# EAGLE board DAC STM32 Board v5 - AD5391 (EAGLE 9.5.2)
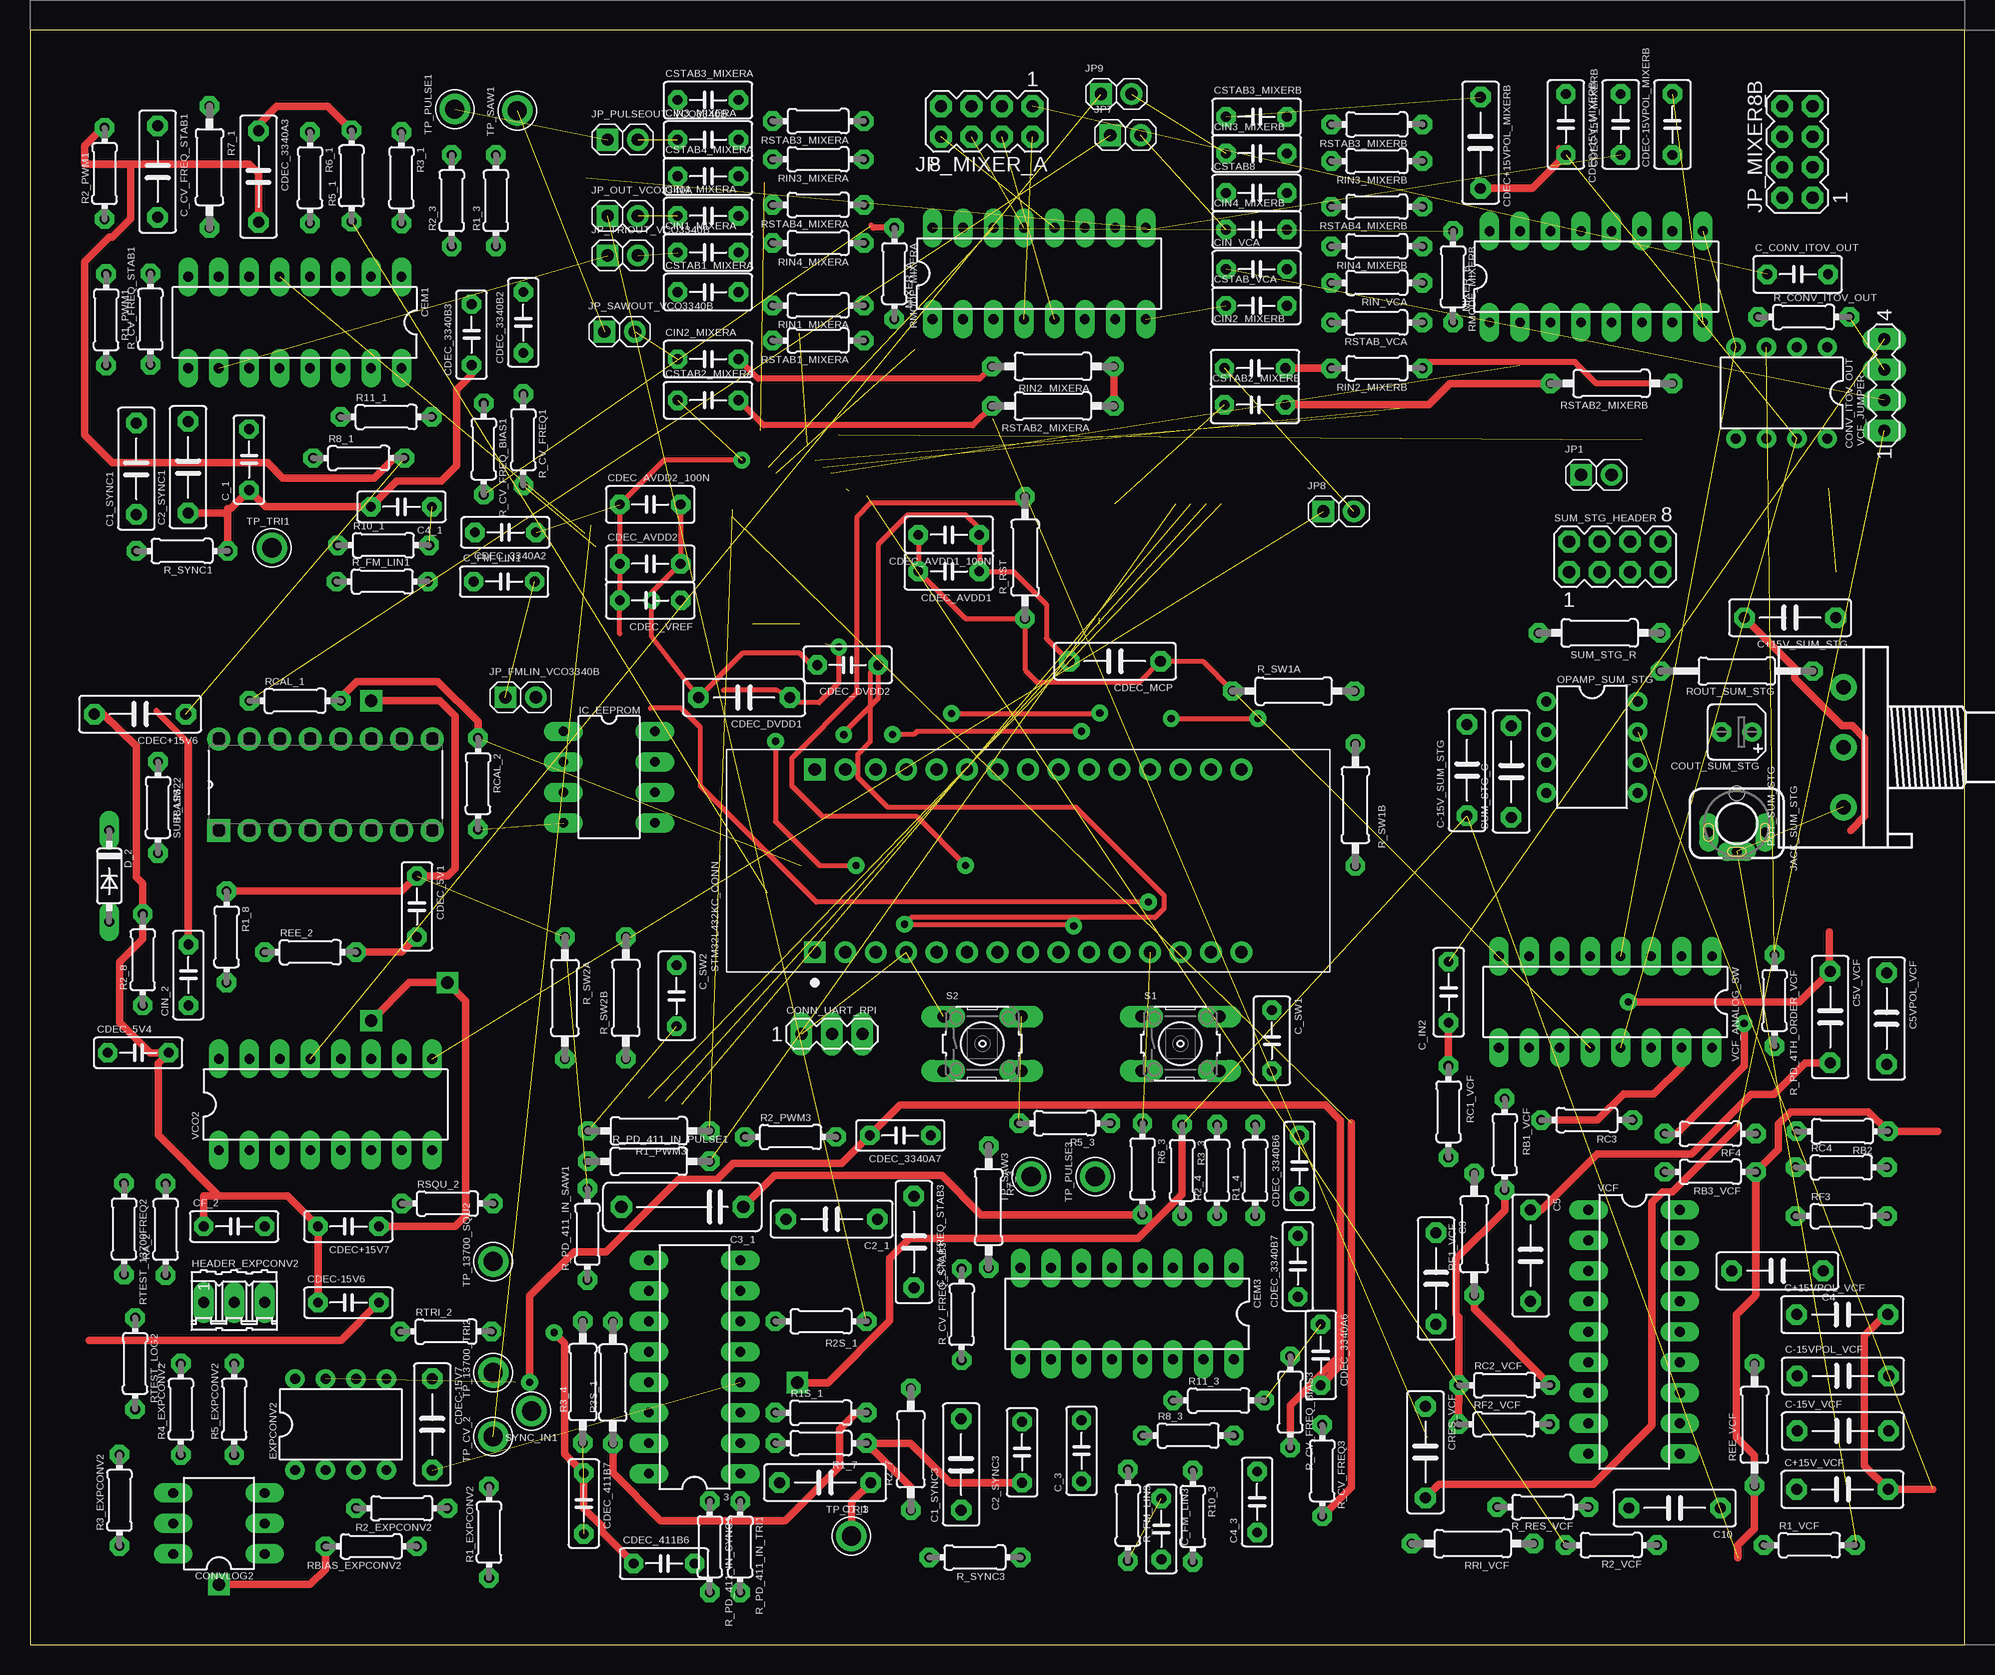
[diagram p6: board, top side]
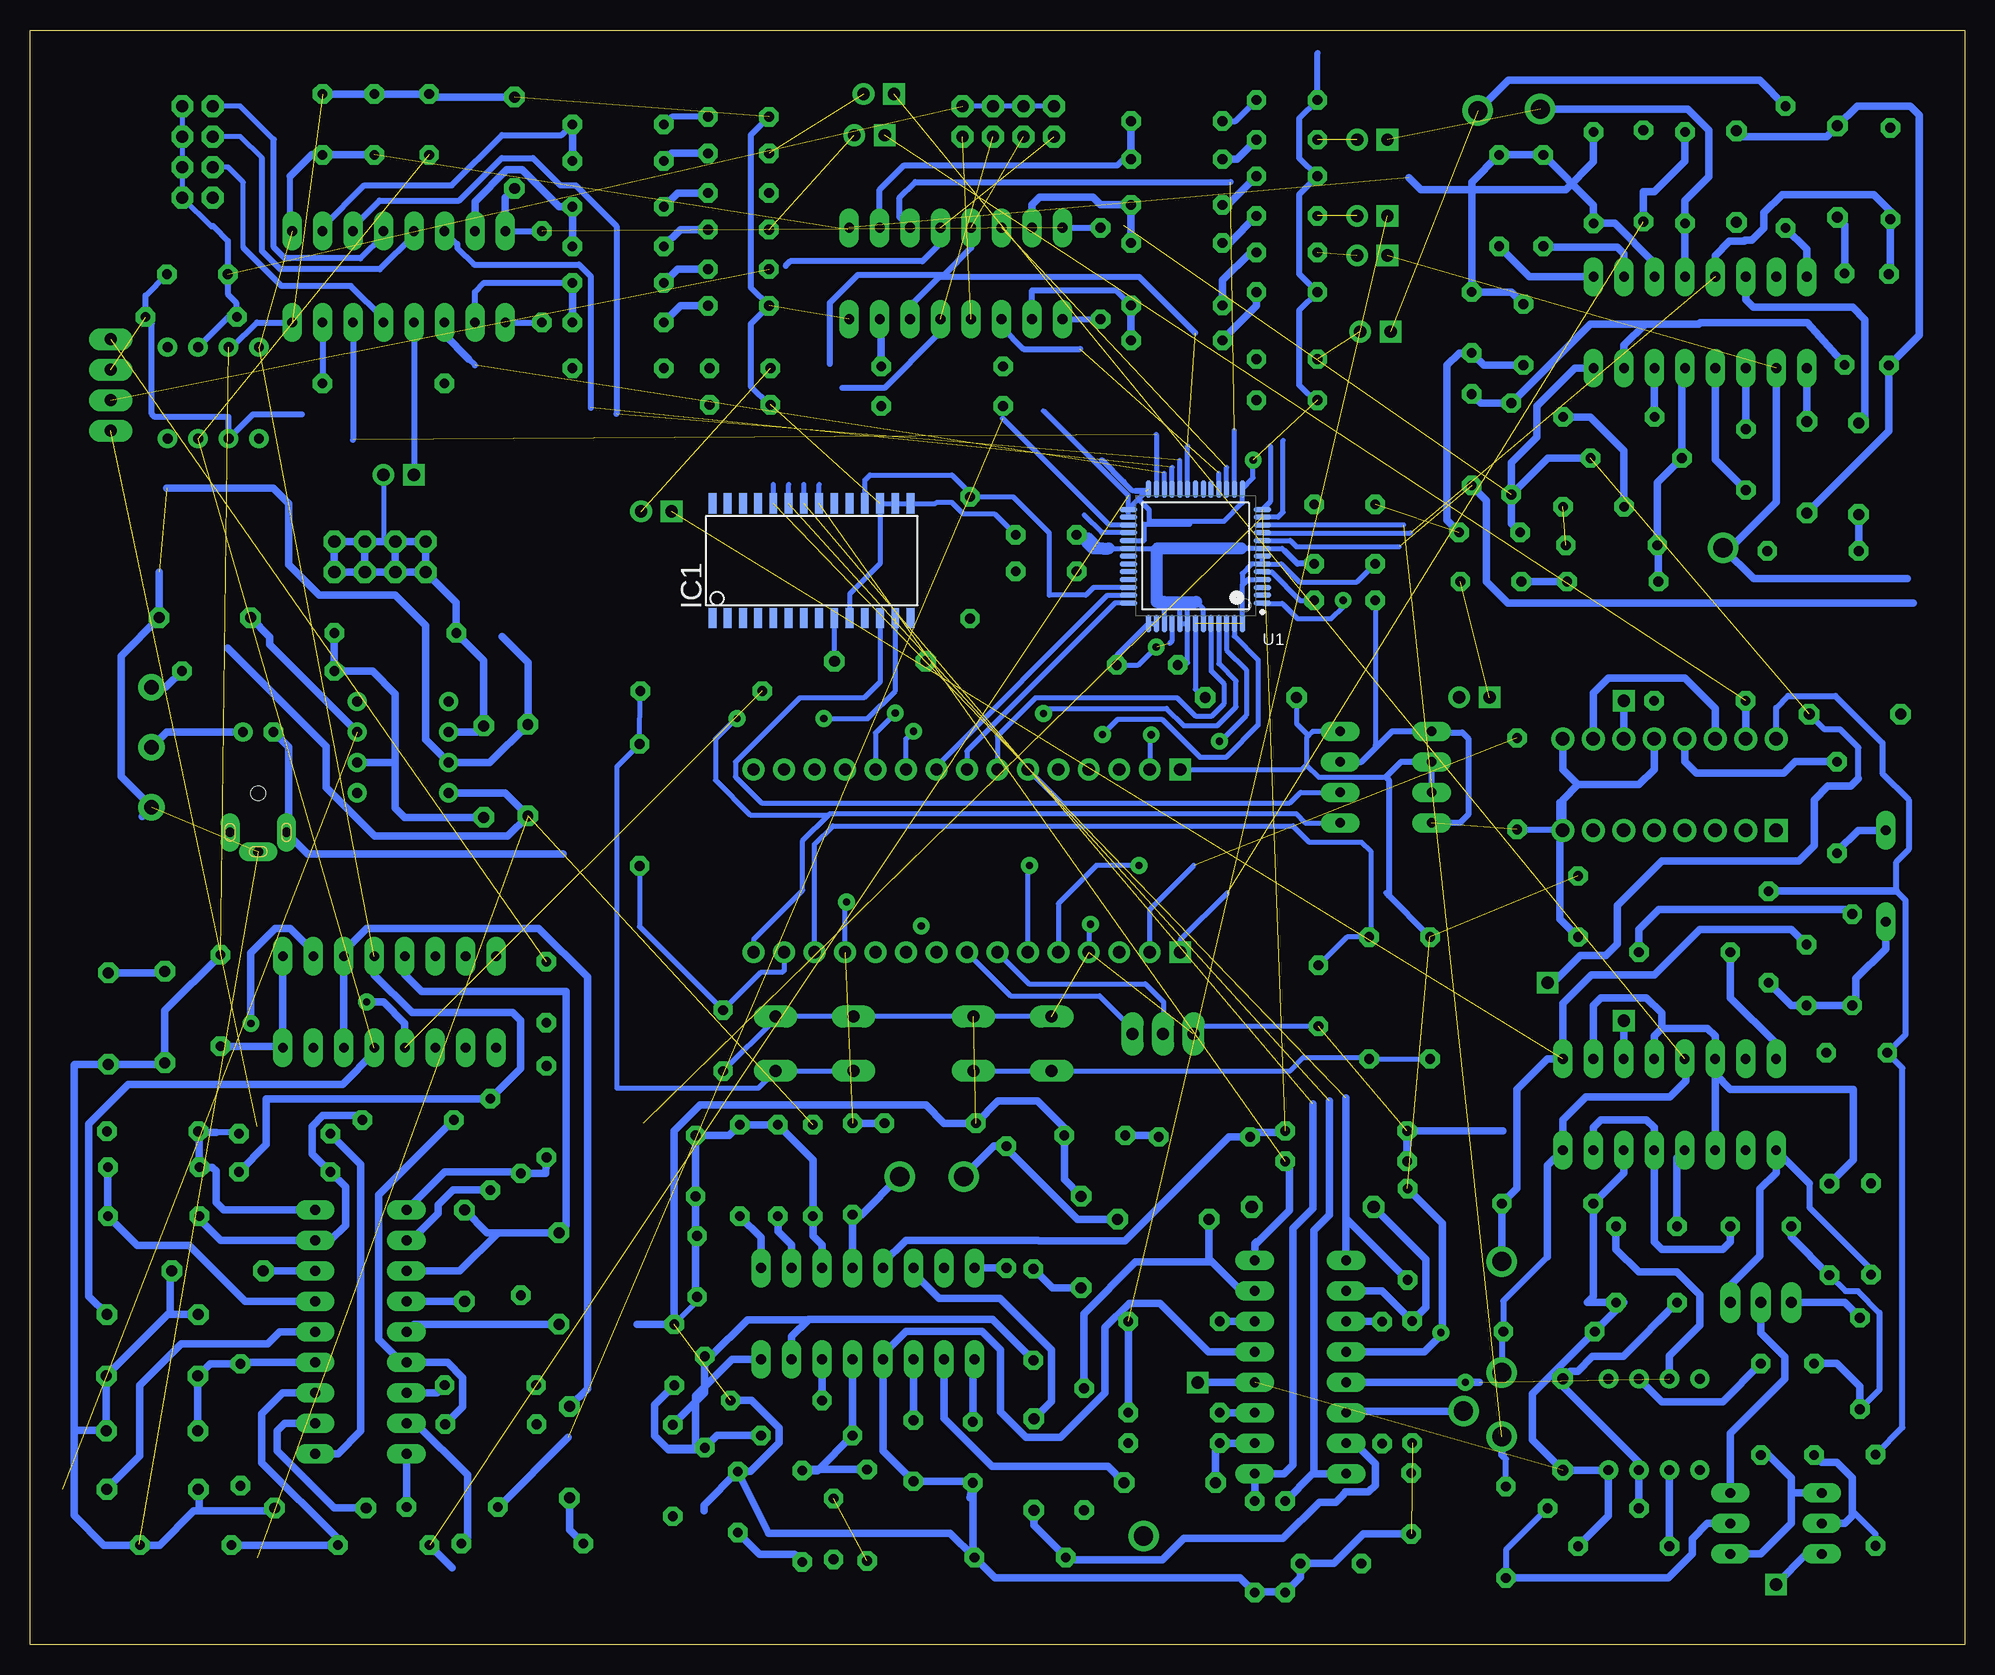
[diagram p7: board, bottom side, seen from below]

Size 161.29 x 134.62 mm. Coordinates in mm from the lower left corner, seen from the top.
Outline: 0,0 161.29,0 161.29,134.62 0,134.62 0,0
Copper layers (1*16): Top 0.035mm / dielectric 1.5mm / Bottom 0.035mm
Design rules "ENSEA_2019 *": minimum track width 0.4mm, minimum drill 0.6mm, track to track 0.4mm, track to pad 0.4mm, pad to pad 0.4mm, via to via 0.4mm, smd to smd 0.4mm, copper to edge 1mm, drill to drill 0.4mm, minimum pad ring 0.4mm, minimum via ring 0.4mm, stop-mask expansion 4mil, vias tented up to drill 0mil, thermal gap 0.4mm

## Footprints (pad centres in the part's own frame; a part is rotated, then mirrored left to right if it is on the bottom)
DIL16 = drill 0.813 long: 1 -8.89,-3.81; 2 -6.35,-3.81; 3 -3.81,-3.81; 4 -1.27,-3.81; 5 1.27,-3.81; 6 3.81,-3.81; 7 6.35,-3.81; 8 8.89,-3.81; 9 8.89,3.81; 10 6.35,3.81; 11 3.81,3.81; 12 1.27,3.81; 13 -1.27,3.81; 14 -3.81,3.81; 15 -6.35,3.81; 16 -8.89,3.81
C075-032X103 = drill 0.914 octagon: 1 -3.81,0; 2 3.81,0
C050-025X075 = drill 0.813 octagon: 1 -2.54,0; 2 2.54,0
C102-043X133 = drill 1.016 octagon: 1 -5.08,0; 2 5.08,0
C050-030X075 = drill 0.813 octagon: 1 -2.54,0; 2 2.54,0
MA03-1 = drill 1.016 long: 1 -2.54,0; 2 0,0; 3 2.54,0
DIL08 = drill 0.813 pad 1.27: 1 -3.81,-3.81; 2 -1.27,-3.81; 3 1.27,-3.81; 4 3.81,-3.81; 5 3.81,3.81; 6 1.27,3.81; 7 -1.27,3.81; 8 -3.81,3.81
DIL06 = drill 0.813 long: 1 -2.54,-3.81; 2 0,-3.81; 3 2.54,-3.81; 4 2.54,3.81; 5 0,3.81; 6 -2.54,3.81
B45181A = drill 0.813 pad 1.6: + -1.27,0 | drill 0.813 pad 1.6 octagon: - 1.27,0
DO35-7 = drill 0.813 long: A 3.81,0; C -3.81,0
03P = drill 0.914 long: 1 -2.54,0; 2 0,0; 3 2.54,0
SO28W = smd 0.65 x 1.7: 1 -7.62,-4.78; 2 -6.35,-4.78; 3 -5.08,-4.78; 4 -3.81,-4.78; 5 -2.54,-4.78; 6 -1.27,-4.78; 7 0,-4.78; 8 1.27,-4.78; 9 2.54,-4.78; 10 3.81,-4.78; 11 5.08,-4.78; 12 6.35,-4.78; 13 7.62,-4.78; 14 8.89,-4.78; 15 8.89,4.78; 16 7.62,4.78; 17 6.35,4.78; 18 5.08,4.78; 19 3.81,4.78; 20 2.54,4.78; 21 1.27,4.78; 22 0,4.78; 23 -1.27,4.78; 24 -2.54,4.78; 25 -3.81,4.78; 26 -5.08,4.78; 27 -6.35,4.78; 28 -7.62,4.78
DIL8 = drill 0.813 long: 1 -3.81,-3.81; 2 -1.27,-3.81; 3 1.27,-3.81; 4 3.81,-3.81; 5 3.81,3.81; 6 1.27,3.81; 7 -1.27,3.81; 8 -3.81,3.81
1502_01 = drill 0.8 pad 1.2 long: 1 0,2.35; 2 -2.35,0.75; 3 2.35,0.75 | hole 1.2: 0,-2.5
HDR2X1 = drill 1.016 square: 1 0,0 | drill 1.016: 2 2.54,0
MA04-2 = drill 1.016 octagon: 1 -3.81,-1.27; 2 -3.81,1.27; 3 -1.27,-1.27; 4 -1.27,1.27; 5 1.27,-1.27; 6 1.27,1.27; 7 3.81,-1.27; 8 3.81,1.27
3RP/1610N = drill 1.2 pad 2.184: 1 -5,0; 2 0,0; 3 5,0
0204/7 = drill 0.813 octagon: 1 -3.81,0; 2 3.81,0
0207/10 = drill 0.813 octagon: 1 -5.08,0; 2 5.08,0
0207/12 = drill 0.813 octagon: 1 -6.35,0; 2 6.35,0
B3F-10XX = drill 1.016 long: 1 -3.251,2.261; 2 3.251,2.261; 3 -3.251,-2.261; 4 3.251,-2.261
MODULE_NUCLEO-F303K8 = drill 1.02 square: 3.1 -7.62,17.78; 4.1 7.62,17.78 | drill 1.02: 3.2 -7.62,15.24; 3.3 -7.62,12.7; 3.4 -7.62,10.16; 3.5 -7.62,7.62; 3.6 -7.62,5.08; 3.7 -7.62,2.54; 3.8 -7.62,0; 3.9 -7.62,-2.54; 3.10 -7.62,-5.08; 3.11 -7.62,-7.62; 3.12 -7.62,-10.16; 3.13 -7.62,-12.7; 3.14 -7.62,-15.24; 3.15 -7.62,-17.78; 4.2 7.62,15.24; 4.3 7.62,12.7; 4.4 7.62,10.16; 4.5 7.62,7.62; 4.6 7.62,5.08; 4.7 7.62,2.54; 4.8 7.62,0; 4.9 7.62,-2.54; 4.10 7.62,-5.08; 4.11 7.62,-7.62; 4.12 7.62,-10.16; 4.13 7.62,-12.7; 4.14 7.62,-15.24; 4.15 7.62,-17.78
DIP254P762X420-16 = drill 1.118 square: 1 -7.62,17.78 | drill 1.118: 2 -7.62,15.24; 3 -7.62,12.7; 4 -7.62,10.16; 5 -7.62,7.62; 6 -7.62,5.08; 7 -7.62,2.54; 8 -7.62,0; 9 0,0; 10 0,2.54; 11 0,5.08; 12 0,7.62; 13 0,10.16; 14 0,12.7; 15 0,15.24; 16 0,17.78
TESTPOINT_63 = drill 1.6 pad 2.54: P$1 0,0
ANALOG_DEVICES_AD5391BSTZ-3_0 = smd 1.45 x 0.45: 1 -5.6,3.9; 2 -5.6,3.25; 3 -5.6,2.6; 4 -5.6,1.95; 5 -5.6,1.3; 6 -5.6,0.65; 7 -5.6,0; 8 -5.6,-0.65; 9 -5.6,-1.3; 10 -5.6,-1.95; 11 -5.6,-2.6; 12 -5.6,-3.25; 13 -5.6,-3.9; 27 5.6,-3.9; 28 5.6,-3.25; 29 5.6,-2.6; 30 5.6,-1.95; 31 5.6,-1.3; 32 5.6,-0.65; 33 5.6,0; 34 5.6,0.65; 35 5.6,1.3; 36 5.6,1.95; 37 5.6,2.6; 38 5.6,3.25; 39 5.6,3.9 | smd 0.45 x 1.45: 14 -3.9,-5.6; 15 -3.25,-5.6; 16 -2.6,-5.6; 17 -1.95,-5.6; 18 -1.3,-5.6; 19 -0.65,-5.6; 20 0,-5.6; 21 0.65,-5.6; 22 1.3,-5.6; 23 1.95,-5.6; 24 2.6,-5.6; 25 3.25,-5.6; 26 3.9,-5.6; 40 3.9,5.6; 41 3.25,5.6; 42 2.6,5.6; 43 1.95,5.6; 44 1.3,5.6; 45 0.65,5.6; 46 0,5.6; 47 -0.65,5.6; 48 -1.3,5.6; 49 -1.95,5.6; 50 -2.6,5.6; 51 -3.25,5.6; 52 -3.9,5.6
DIL18 = drill 0.813 long: 1 -10.16,-3.81; 2 -7.62,-3.81; 3 -5.08,-3.81; 4 -2.54,-3.81; 5 0,-3.81; 6 2.54,-3.81; 7 5.08,-3.81; 8 7.62,-3.81; 9 10.16,-3.81; 10 10.16,3.81; 11 7.62,3.81; 12 5.08,3.81; 13 2.54,3.81; 14 0,3.81; 15 -2.54,3.81; 16 -5.08,3.81; 17 -7.62,3.81; 18 -10.16,3.81
MA04-1 = drill 1.016 long: 1 -3.81,0; 2 -1.27,0; 3 1.27,0; 4 3.81,0

## Placement (x,y rotation side)
3  ADG411N  [DIL16]  55.39,23.17 90 top
C1_1  470n  [C075-032X103]  66.27,13.53 180 top
C1_SYNC1  1n  [C075-032X103]  8.86,98.05 90 top
C1_SYNC3  1n  [C075-032X103]  77.62,15.04 90 top
C2_1  470n  [C075-032X103]  66.82,35.49 180 top
C2_SYNC1  100n  [C075-032X103]  13.18,98.18 90 top
C2_SYNC3  100n  [C050-025X075]  82.7,16.06 90 top
C3  300p  [C075-032X103]  117.2,30.55 270 top
C3_1  470n  [C102-043X133]  54.38,36.51 180 top
C4  300p  [C075-032X103]  145.65,31.18 180 top
C4_1  10n  [C050-025X075]  30.96,94.87 180 top
C4_3  10n  [C050-025X075]  102.29,11.92 90 top
C5  300p  [C075-032X103]  125.08,32.45 270 top
C5V_VCF  100n  [C075-032X103]  150.05,52.34 270 top
C5VPOL_VCF  100n  [C075-032X103]  154.75,52.22 270 top
C10  300p  [C075-032X103]  137.09,11.41 180 top
C+15V_SUM_STG  100n  [C075-032X103]  146.71,85.63 180 top
C+15V_VCF  100n  [C075-032X103]  151.07,12.97 0 top
C+15VPOL_VCF  1u  [C075-032X103]  151.06,27.54 0 top
C-15V_SUM_STG  100n  [C075-032X103]  119.79,72.93 90 top
C-15V_VCF  100n  [C075-032X103]  151.11,17.85 0 top
C-15VPOL_VCF  1u  [C075-032X103]  151.11,22.42 0 top
C_1  1n  [C050-025X075]  18.26,98.81 90 top
C_3  1n  [C050-025X075]  87.65,16.18 90 top
C_CONV_ITOV_OUT  1p  [C050-030X075]  147.34,114.26 0 top
C_CV_FREQ_STAB1  10n  [C075-032X103]  10.64,122.81 270 top
C_CV_FREQ_STAB3  10n  [C075-032X103]  73.68,33.58 270 top
C_FM_LIN1  100n  [C050-025X075]  39.52,88.64 0 top
C_FM_LIN3  100n  [C050-025X075]  94.31,9.67 270 top
C_IN2  470n  [C050-025X075]  118.25,54.42 90 top
C_SW1  100n  [C050-030X075]  103.52,50.37 270 top
C_SW2  100n  [C050-030X075]  53.89,54.11 270 top
CDEC+15V6  100n  [C075-032X103]  9.18,77.6 180 top
CDEC+15V7  100n  [C050-025X075]  26.54,34.89 180 top
CDEC+15V_MIXERB  100n  [C050-030X075]  128.02,126.75 270 top
CDEC+15VPOL_MIXERB  100n  [C075-032X103]  120.9,125.22 270 top
CDEC-15V6  100n  [C050-025X075]  26.54,28.54 0 top
CDEC-15V7  100n  [C075-032X103]  33.53,18.38 270 top
CDEC-15V_MIXERB  100n  [C050-030X075]  132.59,126.75 90 top
CDEC-15VPOL_MIXERB  100n  [C050-030X075]  136.91,126.75 90 top
CDEC_5V1  100n  [C050-025X075]  32.26,61.56 270 top
CDEC_5V4  100n  [C050-025X075]  9.02,49.37 0 top
CDEC_411B6  100n  [C050-025X075]  52.85,6.79 0 top
CDEC_411B7  10u  [C050-025X075]  46.16,11.79 270 top
CDEC_3340A2  100n  [C050-025X075]  39.63,92.74 180 top
CDEC_3340A3  10u  [C075-032X103]  19.05,122.4 270 top
CDEC_3340A6  100n  [C050-025X075]  107.59,24.19 270 top
CDEC_3340A7  10u  [C050-025X075]  72.54,42.47 180 top
CDEC_3340B2  100n  [C050-025X075]  41.12,110.24 90 top
CDEC_3340B3  10u  [C050-025X075]  36.8,109.22 90 top
CDEC_3340B6  100n  [C050-025X075]  105.81,39.93 90 top
CDEC_3340B7  10u  [C050-025X075]  105.68,31.55 90 top
CDEC_AVDD1  10u  [C050-030X075]  76.59,89.49 180 top
CDEC_AVDD1_100N  100n  [C050-030X075]  76.59,92.54 180 top
CDEC_AVDD2  10u  [C050-030X075]  51.7,90.12 0 top
CDEC_AVDD2_100N  100n  [C050-030X075]  51.7,95.08 0 top
CDEC_DVDD1  100n  [C075-032X103]  59.52,78.97 180 top
CDEC_DVDD2  100n  [C050-030X075]  68.16,81.69 180 top
CDEC_MCP  100n  [C075-032X103]  90.43,82 180 top
CDEC_VREF  100n  [C050-030X075]  51.7,87.08 180 top
CEM1  CEM3340  [DIL16]  22.07,110.24 180 top
CEM3  CEM3340  [DIL16]  91.46,27.61 180 top
CF_2  100nF  [C050-025X075]  17.02,34.89 0 top
CIN1_MIXERA  470n  [C050-030X075]  56.52,116.08 0 top
CIN2_MIXERA  470n  [C050-030X075]  56.52,107.19 0 top
CIN2_MIXERB  470n  [C050-030X075]  102.11,106.43 0 top
CIN3_MIXERA  470n  [C050-030X075]  56.52,125.48 0 top
CIN3_MIXERB  470n  [C050-030X075]  102.23,124.33 0 top
CIN4_MIXERA  470n  [C050-030X075]  56.52,119.13 0 top
CIN4_MIXERB  470n  [C050-030X075]  102.23,117.98 0 top
CIN_2  470n  [C050-025X075]  13.21,55.84 90 top
CIN_VCA  470n  [C050-030X075]  102.23,114.68 0 top
CONN_UART_RPI  [MA03-1]  66.85,50.94 0 top
CONV_ITOV_OUT  NE5534AN  [DIL08]  146.01,104.37 180 top
CONVLOG2  BC857BS  [DIL06]  15.75,10.12 90 top
COUT_SUM_STG  22u  [B45181A]  142.27,76.1 180 top
CRES_VCF  1u  [C075-032X103]  116.31,16.07 270 top
CSTAB1_MIXERA  560p  [C050-030X075]  56.52,112.78 0 top
CSTAB2_MIXERA  560p  [C050-030X075]  56.52,103.76 0 top
CSTAB2_MIXERB  560p  [C050-030X075]  102.11,103.38 0 top
CSTAB3_MIXERA  560p  [C050-030X075]  56.52,128.78 0 top
CSTAB3_MIXERB  560p  [C050-030X075]  102.23,127.38 0 top
CSTAB4_MIXERA  560p  [C050-030X075]  56.52,122.43 0 top
CSTAB8  560p  [C050-030X075]  102.23,121.03 0 top
CSTAB_VCA  560p  [C050-030X075]  102.23,111.63 0 top
D_2  1N4148DO35-7  [DO35-7]  6.6,64.1 270 top
EXPCONV2  TL081  [DIL08]  25.91,18.38 0 top
HEADER_EXPCONV2  [03P]  17.02,28.54 0 top
IC1  MCP23017SO  [SO28W]  96.78,90.38 0 bottom
IC_EEPROM  24C04AP  [DIL8]  48.27,72.34 270 top
JACK_SUM_STG  1502_01  [1502_01]  142.27,68.48 180 top
JP1  JUMPER  [HDR2X1]  129.29,97.54 0 top
JP7  JUMPER  [HDR2X1]  90.04,125.86 0 top
JP8  JUMPER  [HDR2X1]  107.82,94.49 0 top
JP9  JUMPER  [HDR2X1]  89.28,129.29 0 top
JP_FMLIN_VCO3340B  JUMPER  [HDR2X1]  39.62,78.99 0 top
JP_MIXER_A  [MA04-2]  79.76,127 180 top
JP_MIXER_B  [MA04-2]  147.32,124.46 90 top
JP_OUT_VCO3340A  JUMPER  [HDR2X1]  48.13,119.13 0 top
JP_PULSEOUT_VCO3340B  JUMPER  [HDR2X1]  48.13,125.48 0 top
JP_SAWOUT_VCO3340B  JUMPER  [HDR2X1]  47.88,109.47 0 top
JP_TRIOUT_VCO3340B  JUMPER  [HDR2X1]  48.13,115.82 0 top
MIXER_A  SSM2164_MULTI  [DIL16]  84.12,114.32 0 top
MIXER_B  SSM2164_MULTI  [DIL16]  130.56,114.05 0 top
OPAMP_SUM_STG  NE5534AN  [DIL08]  130.2,74.83 270 top
POT_SUM_STG  100kB  [3RP/1610N]  151.16,74.83 90 top
R1_3  30k  [0204/7]  38.83,120.4 90 top
R1_4  30k  [0204/7]  102.13,39.55 90 top
R1_7  100k  [0204/7]  65.93,16.82 180 top
R1_8  100k  [0204/7]  16.38,59.02 270 top
R1_EXPCONV2  330  [0204/7]  38.26,9.4 90 top
R1_PWM1  68k  [0204/7]  6.34,110.46 270 top
R1_PWM3  68k  [0207/10]  51.58,42.85 180 top
R1_VCF  10k  [0204/7]  148.32,8.32 0 top
R1S_1  1k  [0204/7]  65.93,19.36 0 top
R2_3  5.6k  [0204/7]  35.15,120.4 90 top
R2_4  5.6k  [0204/7]  98.95,39.55 90 top
R2_7  100k  [0207/10]  73.43,16.31 90 top
R2_8  100k  [0204/7]  9.4,57.11 90 top
R2_EXPCONV2  10  [0204/7]  30.99,11.39 180 top
R2_PWM1  330k  [0204/7]  6.22,122.65 90 top
R2_PWM3  330k  [0204/7]  63.39,42.35 0 top
R2_VCF  100k  [0204/7]  131.81,8.32 180 top
R2S_1  1k  [0204/7]  65.93,26.98 180 top
R3_1  820  [0204/7]  30.96,122.31 270 top
R3_3  820  [0204/7]  96.03,39.55 270 top
R3_4  100k  [0207/10]  46.08,21.91 90 top
R3_EXPCONV2  260  [0204/7]  7.46,12.07 90 top
R3S_1  1k  [0207/10]  48.59,21.86 90 top
R4_EXPCONV2  10  [0204/7]  12.57,19.65 90 top
R5_1  10k  [0204/7]  26.8,122.46 90 top
R5_3  10k  [0204/7]  86.25,43.49 180 top
R5_EXPCONV2  110  [0204/7]  17.02,19.65 90 top
R6_1  33k  [0204/7]  23.34,122.31 270 top
R6_3  33k  [0204/7]  92.73,39.68 270 top
R7_1  5.6k  [0207/10]  14.96,123.19 270 top
R7_3  5.6k  [0207/10]  79.9,36.51 270 top
R8_1  1.5M  [0204/7]  27.4,98.94 0 top
R8_3  1.5M  [0204/7]  96.54,17.45 0 top
R10_1  470  [0204/7]  29.46,91.67 0 top
R10_3  470  [0204/7]  96.92,10.72 270 top
R11_1  1.8k  [0204/7]  29.69,102.37 0 top
R11_3  1.8k  [0204/7]  99.08,20.38 0 top
R_CONV_ITOV_OUT  33K  [0204/7]  147.85,110.7 0 top
R_CV_FREQ1  68k  [0204/7]  41.12,100.46 270 top
R_CV_FREQ3  68k  [0204/7]  107.72,14.53 270 top
R_CV_FREQ_BIAS1  270k  [0204/7]  37.82,99.7 270 top
R_CV_FREQ_BIAS3  270k  [0204/7]  105.05,20.25 270 top
R_CV_FREQ_STAB1  470  [0204/7]  10.04,110.52 90 top
R_CV_FREQ_STAB3  470  [0204/7]  77.65,27.54 90 top
R_FM_LIN1  1M  [0204/7]  29.36,88.64 0 top
R_FM_LIN3  1M  [0204/7]  91.51,10.82 270 top
R_LIM_2  1k  [0204/7]  10.67,69.81 270 top
R_PD_4TH_ORDER_VCF  100k  [0204/7]  145.41,53.72 270 top
R_PD_411_IN_PULSE1  100k  [0207/10]  51.58,40.31 0 top
R_PD_411_IN_SAW1  100k  [0204/7]  46.46,34.23 90 top
R_PD_411_IN_SYNC1  100k  [0204/7]  56.66,8.18 270 top
R_PD_411_IN_TRI1  100k  [0204/7]  59.2,8.18 270 top
R_RES_VCF  100k  [0204/7]  126.09,11.5 180 top
R_RST  10k  [0207/10]  82.94,90.63 90 top
R_SW1A  10k  [0207/10]  105.33,79.51 0 top
R_SW1B  10k  [0207/10]  110.48,70.02 270 top
R_SW2A  10k  [0207/10]  44.59,53.93 270 top
R_SW2B  10k  [0207/10]  49.67,53.93 90 top
R_SYNC1  470k  [0204/7]  12.67,91.19 180 top
R_SYNC3  470k  [0204/7]  78.76,7.29 180 top
RA_2  4.7k  [0204/7]  11.3,34.63 90 top
RB1_VCF  220k  [0204/7]  122.92,41.72 270 top
RB2  220k  [0204/7]  151.07,42.82 180 top
RB3_VCF  220k  [0204/7]  140.06,39.44 180 top
RBIAS_EXPCONV2  47k  [0204/7]  28.45,8.22 180 top
RC1_VCF  91k  [0204/7]  118.24,44.45 270 top
RC2_VCF  91k  [0204/7]  122.92,21.66 0 top
RC3  91k  [0204/7]  129.78,43.76 180 top
RC4  91k  [0204/7]  150.99,39.82 0 top
RCAL_1  47k  [0204/7]  22.1,78.7 0 top
RCAL_2  100k  [0204/7]  37.34,71.79 270 top
REE_2  27k  [0204/7]  23.37,57.75 0 top
REE_VCF  1.5k  [0207/10]  143.75,18.36 90 top
RF1_VCF  100k  [0207/10]  120.38,34.23 90 top
RF2_VCF  100k  [0204/7]  122.87,18.4 0 top
RF3  100k  [0204/7]  150.99,35.75 0 top
RF4  100k  [0204/7]  140.06,42.61 180 top
RIN1_MIXERA  27k  [0204/7]  65.7,111.66 180 top
RIN2_MIXERA  27k  [0207/10]  85.26,106.58 180 top
RIN2_MIXERB  27k  [0204/7]  112.27,106.43 180 top
RIN3_MIXERA  27k  [0204/7]  65.7,123.85 180 top
RIN3_MIXERB  27k  [0204/7]  112.27,123.7 180 top
RIN4_MIXERA  27k  [0204/7]  65.7,116.86 180 top
RIN4_MIXERB  27k  [0204/7]  112.27,116.59 180 top
RIN_VCA  27k  [0204/7]  112.27,113.54 180 top
RMODE_MIXERA  8.2k  [0204/7]  72.05,114.32 270 top
RMODE_MIXERB  8.2k  [0204/7]  118.62,114.05 270 top
ROUT_SUM_STG  470  [0207/12]  142.27,81.18 180 top
RRI_VCF  51k  [0207/10]  120.25,8.45 180 top
RSQU_2  10k  [0204/7]  34.8,36.79 0 top
RSTAB1_MIXERA  470  [0204/7]  65.7,108.73 180 top
RSTAB2_MIXERA  470  [0207/10]  85.26,103.27 180 top
RSTAB2_MIXERB  470  [0207/10]  131.83,105.16 180 top
RSTAB3_MIXERA  470  [0204/7]  65.7,127.02 180 top
RSTAB3_MIXERB  470  [0204/7]  112.27,126.75 180 top
RSTAB4_MIXERA  470  [0204/7]  65.7,120.04 180 top
RSTAB4_MIXERB  470  [0204/7]  112.27,119.89 180 top
RSTAB_VCA  470  [0204/7]  112.27,110.24 180 top
RTEST_13700FREQ2  27k  [0204/7]  7.84,34.67 270 top
RTEST_LOG2  1k  [0204/7]  8.76,23.46 270 top
RTRI_2  12k  [0204/7]  34.67,26.13 0 top
S1  [B3F-10XX]  95.89,50.12 0 top
S2  [B3F-10XX]  79.39,50.12 0 top
STM32L432KC_CONN_  NUCLEO-F303K8  [MODULE_NUCLEO-F303K8]  83.19,65.36 90 top
SUBBASS2  HEF4027BP  [DIP254P762X420-16]  33.53,75.53 90 top
SUM_STG_C  560p  [C075-032X103]  123.47,72.8 90 top
SUM_STG_HEADER  [MA04-2]  132.11,90.71 0 top
SUM_STG_R  27k  [0207/10]  130.84,84.36 180 top
SYNC_IN1  [TESTPOINT_63]  41.8,19.49 180 top
TP_13700_SQU2  [TESTPOINT_63]  38.61,31.97 90 top
TP_13700_TRI2  [TESTPOINT_63]  38.61,22.7 90 top
TP_CV_2  [TESTPOINT_63]  38.61,17.36 90 top
TP_PULSE1  [TESTPOINT_63]  35.41,128.02 90 top
TP_PULSE3  [TESTPOINT_63]  88.79,39.05 90 top
TP_SAW1  [TESTPOINT_63]  40.61,127.89 90 top
TP_SAW3  [TESTPOINT_63]  83.46,39.05 90 top
TP_TRI1  [TESTPOINT_63]  20.17,91.44 0 top
TP_TRI3  [TESTPOINT_63]  68.47,9.07 0 top
U1  ANALOG_DEVICES_AD5391BSTZ-3ANALOG_DEVICES_AD5391BSTZ-3_0_0  [ANALOG_DEVICES_AD5391BSTZ-3_0]  64.14,90.76 180 bottom
VCF  AS3320  [DIL18]  133.71,26.1 270 top
VCF_ANALOG_SW  DG413DJN  [DIL16]  131.32,53.59 180 top
VCF_JUMPER  [MA04-1]  154.56,105.03 90 top
VCO2  LM13700N  [DIL16]  24.64,45.05 0 top

## Tracks (layer width: path | path; a pad name or v marks a point on that pad's centre or on a via)
5V  (via drill 0.6, 1.02)  (3 unrouted)
  Top 0.4: CDEC_AVDD1_100N.2 CDEC_AVDD1.2 77.99,85.55 R_RST.1 82.94,81.27 83.95,80.26 92.51,80.26 CDEC_MCP.1 97.77,82 R_SW1A.1 | CDEC_AVDD2_100N.2 CDEC_AVDD2.2 51.83,87.71 v51.83,87.08 51.83,84.07 CDEC_DVDD1.2 59.42,82.68 64.15,82.68 65.14,81.69 CDEC_DVDD2.2
  Top 0.61: v28.45,78.7 34.16,78.7 35.43,77.43 35.43,64.73 34.8,64.1 CDEC_5V1.1 30.99,62.83 R1_8.1 | v133.22,53.59 147.5,53.59 C5V_VCF.1 149.99,56.22 149.99,59.44 | CDEC_411B6.1 47.67,9.43 47.67,9.88 46.16,11.39 CDEC_411B7.1 44.57,15.92 44.57,25.15 v43.69,26.04
  Bottom 0.4: CDEC_AVDD1_100N.2 73.79,92.54 73.03,92.54 71.91,91.41 | 71.37,91.41 U1.32 67.31,91.41 | 56.91,91.39 58.53,91.39 U1.8 60.33,91.41 | U1.1 58.51,86.82 56.91,86.82 55.64,85.55 52.84,85.55 51.83,86.57 v51.83,87.08 | U1.45 U1.44 65.44,86.93 65.43,86.94 | U1.45 64.8,81.88 64.99,81.69 CDEC_DVDD2.2 | IC_EEPROM.8 54.37,76.15 54.72,75.8 | 54.72,75.8 54.87,75.65 54.87,73.36 | 54.87,73.36 53.86,72.34 48.27,72.34 | STM32L432KC_CONN_.4.1 55.26,72.98 54.87,73.36 | CDEC_DVDD1.2 55.71,76.79 54.72,75.8 | U1.47 63.49,86.36 64.08,86.94 64.85,86.94 | 64.85,86.94 65.43,86.94 | 65.43,86.94 66.75,86.94 U1.42 | U1.45 64.8,86.89 64.85,86.94 | 48.27,62.69 48.03,62.46 | 44.8,59.22 R_SW2A.1 | CDEC_MCP.1 94.24,84.79 | 94.24,84.79 | 94.24,84.79 IC1.9
  Bottom 0.508: CDEC_AVDD2.2 55.64,90.12 56.72,91.2 | R3_EXPCONV2.2 5.21,18.12 5.21,48.1 CDEC_5V4.1 4.95,50.89 4.95,62.07 5.71,62.83 5.71,65.28 4.7,66.29 4.7,70.47 6.88,72.65 6.88,75.19 10.79,79.11 14.72,79.11 14.73,79.12 15.75,78.11 SUBBASS2.16 | IC_EEPROM.3 IC_EEPROM.2 47,73.61 48.27,72.34 48.03,72.11 48.03,62.46 44.8,59.22
  Bottom 0.61: 5.71,62.83 R1_8.1 | SUBBASS2.11 v28.45,78.7 | VCF_ANALOG_SW.12 130.05,51.82 131.83,53.59 v133.22,53.59 | C5VPOL_VCF.1 150.18,56.02 C5V_VCF.1 | 51.46,24.31 3.12 45.06,24.44 43.69,25.81 v43.69,26.04 43.56,26.16 43.56,35.14 R_PD_411_IN_SAW1.2
  Bottom 1.016: 60.33,91.41 67.31,91.41 67.38,91.34 67.38,86.94 66.75,86.94 64.08,86.94 | 73.79,92.54 72.66,91.41 71.91,91.41 71.37,91.41
411_IN_PULSE  (1 unrouted)
  Bottom 0.4: IC1.21 95.51,96.73
  Bottom 0.61: 3.8 59.2,33.46 59.05,33.6 59.05,33.48 56.32,36.22 56.32,39.97 R_PD_411_IN_PULSE1.2
411_IN_SAW  (1 unrouted)
  Bottom 0.4: IC1.24 99.32,96.73
  Bottom 0.61: 3.9 51.58,35.55 | 51.58,45.6 51.58,35.55 | 51.58,35.55 R_PD_411_IN_SAW1.1
411_IN_SYNC  (1 unrouted)
  Bottom 0.4: IC1.23 98.05,96.73
  Bottom 0.61: R_PD_411_IN_SYNC1.1 54.38,14.28 3.16 54.15,14.28 54.28,14.42 54.28,34.54 52.96,35.87 52.96,45.34
411_IN_TRI  (1 unrouted)
  Bottom 0.4: IC1.22 96.78,96.73
  Bottom 0.61: R_PD_411_IN_TRI1.1 3.1 56.77,14.28 56.03,15.02 56.03,34.73 54.36,36.4 54.36,45.09
2164_IN1_MIXA
  Bottom 0.508: MIXER_A.2 77.77,112.93 70.78,112.93 RIN1_MIXERA.1
  Bottom 0.61: RIN1_MIXERA.1 RSTAB1_MIXERA.1
2164_IN1_MIXB
  Bottom 0.508: MIXER_B.2 124.21,112.8 123.47,113.54 RIN_VCA.1
  Bottom 0.61: RSTAB_VCA.1 RIN_VCA.1
2164_IN2_MIXA
  Top 0.61: RIN2_MIXERA.1 RSTAB2_MIXERA.1
  Bottom 0.61: RIN2_MIXERA.1 90.34,110.39 MIXER_A.7
2164_IN2_MIXB
  Top 0.508: RSTAB2_MIXERB.1 130.56,105.16 128.78,106.93 116.59,106.93 RIN2_MIXERB.1
  Bottom 0.508: MIXER_B.7 RSTAB2_MIXERB.1
2164_IN3_MIXA
  Bottom 0.508: MIXER_A.10 90.47,121.31 88.43,123.34 70.65,123.34 69.51,124.48 RSTAB3_MIXERA.1
  Bottom 0.61: RSTAB3_MIXERA.1 RIN3_MIXERA.1
2164_IN3_MIXB
  Bottom 0.508: RSTAB3_MIXERB.1 116.97,125.86 121.94,125.86 126.14,121.67 133.43,121.67 136.91,118.19 MIXER_B.10
  Bottom 0.61: RIN3_MIXERB.1 RSTAB3_MIXERB.1
2164_IN4_MIXA
  Bottom 0.61: RIN4_MIXERA.1 RSTAB4_MIXERA.1 72.05,120.04 72.69,120.67 77.13,120.67 77.77,120.04 MIXER_A.15
2164_IN4_MIXB
  Bottom 0.61: RIN4_MIXERB.1 RSTAB4_MIXERB.1 117.17,119.89 120.26,122.97 121.55,122.97 124.21,120.32 MIXER_B.15
2164_MODE_MIXA
  Bottom 0.508: MIXER_A.1 RMODE_MIXERA.2
2164_MODE_MIXB
  Bottom 0.508: MIXER_B.1 RMODE_MIXERB.2
2164_OUT1_MIXA  (1 unrouted)
2164_OUT2_MIXA  (1 unrouted)
  Bottom 0.508: MIXER_A.5 85.72,110.17 85.72,109.12 90.08,104.78 93.6,104.78
2164_OUT2_MIXB
  Bottom 0.4: 143.51,116.48 143.51,121.92 144.78,123.19 JP_MIXER_B.4
  Bottom 0.508: MIXER_B.5 131.83,110.57 134.54,113.28 140.31,113.28 143.51,116.48
2164_OUT3_MIXA  (1 unrouted)
  Bottom 0.508: MIXER_A.12 85.39,116.86 86.9,115.35 97.92,115.35 98.3,114.97
2164_OUT3_MIXB
  Bottom 0.4: 140.97,125.48 143.76,128.27 JP_MIXER_B.8
  Bottom 0.508: MIXER_B.12 131.83,117.52 133.76,115.59 140.05,115.59 140.97,116.51 140.97,125.48
2164_OUT4_MIXA  (1 unrouted)
  Bottom 0.508: MIXER_A.13 82.85,116.46 85.11,114.2 92.31,114.2 94.61,111.89 94.61,106.81
2164_OUT4_MIXB
  Bottom 0.4: 141.95,123.91 143.76,125.73 JP_MIXER_B.6
  Bottom 0.508: MIXER_B.13 129.29,117.52 132.13,114.68 140.43,114.68 141.95,116.2 141.95,123.91
+15V  (via drill 0.6, 1.02)  (7 unrouted)
  Top 0.508: RMODE_MIXERA.1 70.31,118.13 70.12,118.32 | CDEC+15V_MIXERB.2 127.44,124.78
  Top 0.61: CDEC+15VPOL_MIXERB.2 125.22,121.41 CDEC+15V_MIXERB.2 | CDEC_3340A6.2 109.24,23.3 109.24,43.72 107.96,45 72.53,45 CDEC_3340A7.2 67.66,40.13 58.62,40.13 57.29,38.8 54.04,38.8 48.01,32.77 45.34,32.77 41.66,29.08 v41.66,21.9 | v28.45,52.03 31.62,55.21 v34.8,55.21 36.32,53.68 36.32,35.78 35.43,34.89 CDEC+15V7.1 | R8_1.2 30.36,98.94 28.7,97.28 21.08,97.28 19.81,98.55 6.86,98.55 4.57,100.84 4.57,115.32 6.59,117.33 6.84,117.33 8.38,118.87 8.38,123.44 | R2_PWM1.2 6.07,126.47 4.57,124.97 4.57,123.44 8.38,123.44 | CDEC_3340A3.2 19.05,122.68 18.29,123.44 8.38,123.44 | C+15VPOL_VCF.2 154.67,27.54 152.91,25.78 152.91,14.95 C+15V_VCF.2 158.6,12.97 158.62,12.95 | C+15V_SUM_STG.2 147.11,81.42 147.11,80.56 151.03,76.63 151.9,76.63 152.96,75.58 152.96,69.09 151.76,67.9 | R_CV_FREQ_BIAS3.2 105.05,20 109.19,24.13
  Bottom 0.508: MIXER_B.16 RMODE_MIXERB.1 | MIXER_A.16 RMODE_MIXERA.1 | CDEC+15V6.1 11.72,76.33 10.41,76.33 8.89,74.8 8.89,72.23
  Bottom 0.61: CDEC+15VPOL_MIXERB.2 121.67,120.65 MIXER_B.16 | R8_1.2 34.77,98.94 R_CV_FREQ_BIAS1.2 | 108.19,16.4 105.09,16.4 R_CV_FREQ_BIAS3.2 104.03,17.45 R8_3.2 | CDEC_3340A7.2 67.33,42.47 R2_PWM3.2 | CEM3.16 102.76,23.8 105.79,20.78 105.79,16.27 108.06,16.27 108.19,16.4 | 8.89,72.23 9.52,71.59 11.43,71.59 12.57,70.45 12.57,66.64 13.84,65.37 25.27,65.37 28.99,61.65 28.99,58.45 29.95,57.49 32.04,57.49 34.32,55.21 v34.8,55.21 | EXPCONV2.7 24.64,24.09 22.1,26.63 22.1,29.17 24,31.08 27.18,31.08 29.08,32.98 CDEC+15V7.1 | VCO2.11 v28.45,52.03 | VCF.14 140.46,26.1 141.46,25.11 148.68,25.11 152.13,21.66 152.13,15.75 154.88,12.99 C+15V_VCF.2 | R_CV_FREQ_BIAS1.2 37.82,93.47 CDEC_3340A2.2 | CEM1.16 32.51,106.43 35.69,103.25 35.69,100.68 37.82,98.55 R_CV_FREQ_BIAS1.2 | C+15VPOL_VCF.2 156.39,29.06 156.39,43.44 153.1,46.74 135.23,46.74 132.59,49.38 VCF_ANALOG_SW.13 | 3.13 v41.66,21.9 40.46,21.9 | OPAMP_SUM_STG.7 141.3,83.39 141.3,84.02 C+15V_SUM_STG.2 | 108.19,16.4 109.23,17.44 109.23,20.01 CDEC_3340A6.2
-15V  (via drill 1.02)  (7 unrouted)
  Top 0.61: CDEC-15V6.2 25.92,25.38 4.94,25.38 | 142.36,7.26 142.36,8.31 143.75,9.7 REE_VCF.1 143.75,15.82 142.24,17.33 142.24,27.51 143.87,29.15 RB3_VCF.1 145.75,41.31 145.75,43.44 146.76,44.45 153.25,44.45 RB2.1 158.99,42.82 159,42.8 | v63.95,21.86 66.51,21.86 71.65,27 71.65,32.24 73.3,33.88 92.37,33.88 96.03,37.54 R3_3.1
  Bottom 0.508: MIXER_B.9 139.6,118.01 139.6,122.43 | 93.16,117.98 MIXER_A.9
  Bottom 0.61: CDEC-15V_MIXERB.1 CDEC-15VPOL_MIXERB.1 137.82,124.21 139.6,122.43 | 144.81,83.09 136.59,74.87 136.59,71.46 132.56,67.43 121.48,67.43 C-15V_SUM_STG.1 121.69,71.02 OPAMP_SUM_STG.4 | 3.4 63.93,21.89 v63.95,21.86 | RBIAS_EXPCONV2.1 29.72,10.76 EXPCONV2.4 CDEC-15V7.2 36.07,17.11 36.07,20.92 RTRI_2.1 28.45,28.54 CDEC-15V6.2 31.5,28.54 30.99,29.05 RSQU_2.1 28.45,39.33 VCO2.6 | R3_1.1 30.96,123.62 33.27,121.31 45.36,121.31 46.35,122.3 | RB3_VCF.1 141.6,41.71 141.6,45.53 RB1_VCF.1 120.41,48.04 120.41,52.07 121.04,52.7 129.44,52.7 132.59,55.85 VCF_ANALOG_SW.4
AGND  (via drill 0.6)  (20 unrouted)
  Top 0.4: 57.78,79.58 62.22,79.58 CDEC_DVDD1.1 63.77,78.54 65.79,78.54 67.41,80.16 v67.41,83.19 67.36,83.19 | 49.16,84.28 CDEC_VREF.2 CDEC_AVDD2.1 CDEC_AVDD2_100N.1 52.84,98.75 v59.33,98.75 | CDEC_DVDD2.1 70.7,78.9 67.83,76.03 v67.83,75.87 | CDEC_DVDD2.1 70.7,91.72 73.16,94.19 77.99,94.19 79.13,93.05 CDEC_AVDD1_100N.1 CDEC_AVDD1.1 81.96,89.49 84.71,86.74 84.71,83.91 CDEC_MCP.2 | CDEC_DVDD2.1 70.04,81.03 70.04,75.29 68.98,74.24 68.98,72.35 71.5,69.84 87.15,69.84 94.53,62.47 94.53,61.39 93.77,60.63 73.46,60.63 v72.9,60.07 86.87,60.07 v87,59.94
  Top 0.61: C5.1 125.98,36.26 130.66,40.95 138.5,40.95 143.46,45.9 145.34,45.9 147.97,48.53 C5V_VCF.2 | CDEC+15V7.2 CDEC-15V6.1 | 15.75,37.43 10.67,42.51 10.67,48.48 CDEC_5V4.2 10.03,49.37 7.49,51.91 7.49,56.94 9.4,58.84 R2_8.2 | CF_2.1 14.48,37.43 15.75,37.43 | R2_8.2 9.4,63.46 8.86,64 8.86,74.93 6.09,77.62 CDEC+15V6.2 | 15.75,37.43 21.46,37.43 CDEC+15V7.2 | REE_2.2 30.99,57.75 CDEC_5V1.2 | 22.1,36.79 CDEC+15V7.2 | R2_8.2 9.4,60.26 | 16.48,94.23 16.48,94.72 16.51,94.74 16.73,94.74 C_1.1 19.66,94.87 C4_1.2 30.57,97.03 34.29,97.03 35.56,98.3 35.56,104.65 36.8,105.89 CDEC_3340B3.1 | 16.48,94.23 R_SYNC1.1 | C2_SYNC1.1 16.35,94.37 16.48,94.23 | R5_1.2 24.8,128.27 20.57,128.27 19.05,126.74 CDEC_3340A3.1 | C2_SYNC3.1 76.68,13.52 73.38,16.82 R1_7.1 73.43,13.14 R2_7.1
  Bottom 0.4: U1.6 U1.7 | U1.6 56.98,90.11 55.47,88.6 50.68,88.6 CDEC_AVDD2.1 | U1.52 60.24,88.35 | 60.24,88.35 59.79,88.81 U1.4 | U1.6 59.46,90.11 60.24,89.33 60.24,88.35 | U1.41 U1.40 70.7,82.51 CDEC_DVDD2.1 68.91,81.69 v67.41,83.19 | U1.31 68.4,92.06 68.4,93.42 68,93.42 | 68,93.42 64.63,93.42 | CDEC_VREF.2 49.16,75.01 49.03,74.88 | v67.83,75.87 67.95,75.74 STM32L432KC_CONN_.4.2 | U1.27 68.89,95.51 | 68.89,95.51 U1.26 | 68,93.42 68,93.68 | 68,93.68 68,94.61 68.89,95.51 | 68,93.68 61.73,93.68 60.21,95.2 60.21,96.32 U1.14 59.33,97.27 v59.33,98.75 | S2.1 S2.2 S1.1 S1.2 99.15,52.2 C_SW1.2 | U1.46 64.14,79.66 63.45,78.97 CDEC_DVDD1.1 | v72.9,60.07 73.03,59.93 STM32L432KC_CONN_.3.4 | 70.13,96.93 69.39,96.19 69.14,96.19 | 66.29,83.49 66.12,83.66 66.12,85.13 U1.43 | 41.38,107.95 CDEC_3340B2.1 | CDEC_3340A6.1 105.81,28.5 CDEC_3340B6.1 | C_SW2.2 63.67,51.57 CONN_UART_RPI.1 | CDEC_AVDD1_100N.1 80.9,94.31 83.52,94.31 84.47,95.25 85.72,95.25 85.82,95.16 IC1.15 IC1.16 IC1.17 90.43,90.16 92.97,87.62 IC1.10
  Bottom 0.508: CSTAB2_MIXERA.1 53.98,103.5 55.5,105.03 55.5,111.25 CSTAB1_MIXERA.1 55.5,114.3 55.5,120.9 CSTAB4_MIXERA.1 55.5,123.95 55.5,127.25 CSTAB3_MIXERA.1 53.98,132.72 | MIXER_B.8 142.37,110.24 144.42,108.18 CONV_ITOV_OUT.3 | CSTAB3_MIXERB.1 101.22,125.86 101.22,113.16 CSTAB_VCA.1 101.22,110.11 101.22,104.9 99.69,103.38 CSTAB2_MIXERB.1 | RA_2.1 9.97,29.5 8.93,29.5 7.13,27.7 7.13,21.28 RTEST_LOG2.2 | RCAL_2.2 33.6,67.98 SUBBASS2.8 | 69.14,96.19 68.29,96.19 68.27,96.17 | 70.13,96.93 71.96,98.76 | IC_EEPROM.4 42.08,68.53 41.4,69.22 41.4,75.56 41.91,76.07 44.38,76.07 IC_EEPROM.1 47.76,76.15 49.03,74.88 50.3,73.61 IC_EEPROM.7
  Bottom 0.61: CDEC-15VPOL_MIXERB.2 CDEC-15V_MIXERB.2 CDEC+15V_MIXERB.1 127.76,129.03 CDEC+15VPOL_MIXERB.1 | 122.28,34.36 C3.1 116.6,34.96 116.6,54.48 128.65,54.48 130.05,55.88 VCF_ANALOG_SW.5 | 152.21,8.4 R1_VCF.2 | R1_VCF.2 150.48,8.32 147.62,11.18 147.19,11.18 | C10.1 141.14,11.18 147.19,11.18 | 147.19,11.18 147.19,12.9 C+15V_VCF.1 | 149.61,27.54 149.8,27.54 C-15VPOL_VCF.2 C-15V_VCF.2 154.98,17.91 157.61,17.91 | 149.61,27.54 C+15VPOL_VCF.1 | C4.1 149.61,31.04 149.61,27.54 | 157.61,17.91 157.61,10.79 155.13,8.32 R1_VCF.2 | VCF.3 125.46,31.18 122.28,34.36 | 157.61,17.91 157.61,48.35 157.55,48.41 C5VPOL_VCF.2 150.18,48.41 C5V_VCF.2 150.06,52.89 R_PD_4TH_ORDER_VCF.1 | 122.28,34.36 123.17,34.36 C5.1 | 150.52,89.44 C+15V_SUM_STG.1 153.7,82.45 153.7,72.37 POT_SUM_STG.1 151.93,69.06 | 149.89,96.42 141,96.42 139.73,95.15 139.73,90.07 137.19,87.53 130.84,87.53 128.3,84.99 128.3,75.47 OPAMP_SUM_STG.3 122.96,73.56 C-15V_SUM_STG.2 119.79,81.88 121.95,84.04 | R11_1.2 31.21,102.37 28.42,99.57 C4_1.2 | CDEC_3340B3.1 40.1,106.69 CDEC_3340B2.1 42.16,107.7 43.18,106.68 43.18,93.75 CDEC_3340A2.1 | C_CV_FREQ_STAB3.1 75.08,38.79 CDEC_3340A7.1 75.08,43.11 77.31,45.34 80.6,45.34 R5_3.2 85.11,43.49 86.62,45 105.42,45 107.59,42.83 CDEC_3340A6.1 110.67,26.73 | C2_SYNC3.1 82.7,7.42 R_SYNC3.1 | CDEC_3340B6.1 105.81,29.14 CDEC_3340B7.1 | 38.5,42.85 R1_PWM3.2 R_PD_411_IN_PULSE1.1 | R2_EXPCONV2.2 EXPCONV2.3 27.18,15.2 33.53,21.55 CDEC-15V7.1 32.89,22.82 32.28,22.82 31.04,24.06 28.48,24.06 CDEC-15V6.1 25.55,26.99 | VCO2.4 24,40.6 CDEC+15V7.2 | SUBBASS2.12 25.91,72.99 27.18,71.72 32.26,71.72
  Bottom 0.61: 32.26,71.72 33.53,72.99 SUBBASS2.9 | R2_8.2 9.4,61.08 9.61,61.3 25.53,61.3 27.18,59.65 REE_2.2 | R4_EXPCONV2.2 10.67,23.46 8.76,21.55 RTEST_LOG2.2 | CF_2.1 14.48,34 RA_2.1 | 32.26,71.72 33.53,70.45 | 33.53,70.45 SUBBASS2.8 | C2_SYNC1.1 6.34,101.2 R1_PWM1.2 3.81,109.19 3.81,127.51 4.57,128.27 8.99,128.27 C_CV_FREQ_STAB1.1 11.54,125.73 18.56,125.73 CDEC_3340A3.1 | CEM1.12 20.8,98.81 C_1.1 | CDEC_5V1.2 33.77,60.53 33.77,70.21 33.53,70.45 | 3.5 63.05,24.44 67.1,28.49 69.66,28.49 71.68,26.47 71.68,21 75.39,17.29 78.27,17.29 80.41,19.43 80.41,24.58 81.94,26.12 88.28,26.12 90.17,24.23 90.17,23.83 CEM3.12 90.19,16.18 C_3.1 82.83,13.64 C2_SYNC3.1 | R_SYNC3.1 80.86,5.59 60.42,5.59 R_PD_411_IN_TRI1.2 59.13,4.45 56.66,4.45 R_PD_411_IN_SYNC1.2 55.39,5.64 CDEC_411B6.2 52.6,6.79 50.13,9.25 CDEC_411B7.2 | R_SYNC3.1 84.6,9.33 99.72,9.33 C4_3.2 | 82.93,12.25 C2_SYNC3.1 | R11_3.2 101.13,20.38 98.84,18.08 98.84,16.83 101.21,14.46 C4_3.2 | C4_3.2 105.11,11.63 105.11,11.19
BIAS_4027_VCO13700
  Bottom 0.61: R1_8.2 14.48,53.3 CIN_2.1 R2_8.1 9.09,53.61 9.09,55.54 6.6,58.03 D_2.A
CALIB_3340A  (via drill 0.6)  (1 unrouted)
  Top 0.4: v93.23,61.93 65.54,61.93 55.89,71.58 55.89,76.48 54.29,78.09 51.71,78.09
  Bottom 0.4: STM32L432KC_CONN_.3.12 93.36,61.8 v93.23,61.93
  Bottom 0.61: R6_3.1 R5_3.1
CALIB_3340B  (1 unrouted)
  Bottom 0.4: 61.48,62.69 65.42,58.76 STM32L432KC_CONN_.3.1
  Bottom 0.61: R5_1.1 26.8,121.16 25.91,121.16 23.37,123.7 23.37,126.09 R6_1.1
CALIB_13700  (1 unrouted)
  Top 0.61: RCAL_2.1 37.34,76.95 33.98,80.32 27.25,80.32 25.91,78.98 RCAL_1.2
  Bottom 0.4: STM32L432KC_CONN_.3.2 67.95,61.3 64.27,64.98
CAP1_VCF
  Bottom 0.61: VCF.5 129.27,26.74 C3.2
CAP2_VCF
  Bottom 0.61: VCF.4 C5.2
CAP3_VCF
  Bottom 0.61: VCF.16 C4.2
CAP4_VCF
  Bottom 0.61: VCF.11 140.06,18.48 140.7,17.85 140.7,16.17 135.94,11.41 C10.2
CV_CUTOFF  (1 unrouted)
  Bottom 0.4: U1.28 69.75,95.79 76.83,102.87
  Bottom 0.61: 126.09,6.42 R2_VCF.2
CV_FREQ_3340A  (1 unrouted)
  Top 0.61: 110.13,43.52 110.13,13.14 R_CV_FREQ3.2
  Bottom 0.4: U1.12 57.25,94.01 56.84,94.43 56.84,100.43
CV_FREQ_3340B  (1 unrouted)
  Bottom 0.4: U1.9 56.23,92.06 55.73,91.56 47.16,91.56
  Bottom 0.61: R_CV_FREQ1.2 39.88,95.41 39.88,88.65 38.1,86.87 4.32,86.87
CV_FREQ_13700  (1 unrouted)
  Bottom 0.4: 46.79,93.36 U1.11
  Bottom 0.508: R1_EXPCONV2.2 38.26,15.49 38.48,15.71
  Bottom 0.61: TP_CV_2.P$1 38.61,15.84 38.48,15.71
CV_PWM_3340A  (1 unrouted)
  Bottom 0.4: U1.13 57.91,95.29 57.91,99.95
  Bottom 0.61: CEM3.5 90.19,31.83 88.28,33.74 77.27,33.74 77.2,33.67 70.04,33.67 61.36,42.35 R2_PWM3.1 59.2,42.73 56.79,42.73 R1_PWM3.1
CV_PWM_3340B  (1 unrouted)
  Bottom 0.4: U1.10 58.52,92.68 46.23,92.68
  Bottom 0.61: CEM1.5 20.8,115.8 20.83,115.82 19.62,117.03 18.4,117.03 18.33,117.09 17.78,117.09 16.76,118.11 16.76,119.38 15.24,120.9 7.62,120.9 6.22,119.5 R2_PWM1.1 6.22,114.4 R1_PWM1.1
CV_RES  (1 unrouted)
  Bottom 0.4: U1.29 71.29,93.36 80.17,102.23 80.25,102.23
  Bottom 0.61: R_RES_VCF.2 122.28,11.45 116.43,17.3
DAC_BUSY
  Bottom 0.4: STM32L432KC_CONN_.4.9 85.73,73.23 71.46,87.51 U1.38
DAC_LDAC
  Bottom 0.4: STM32L432KC_CONN_.4.8 83.19,74.5 70.84,86.86 U1.39
DAC_SYNC  (via drill 0.6)
  Top 0.4: v87.64,76.15 73.92,76.15 73.67,75.9 v71.89,75.9
  Bottom 0.4: U1.51 60.9,84.09 58.92,82.11 58.92,76.68 61.58,74.02 63.78,74.02 66.94,77.17 70.62,77.17 v71.89,75.9 | STM32L432KC_CONN_.4.10 88.28,75.52 v87.64,76.15
FM_ENTREE_13700_VCO13700
  Bottom 0.508: 12.97,38.46 12.97,36.47 7.84,31.33 RTEST_13700FREQ2.2
  Bottom 0.61: 12.97,38.46 VCO2.1 15.75,39.36 17.1,38 17.1,32.44 19.56,29.98 HEADER_EXPCONV2.3
FREQ_CTRL_VCOA
  Bottom 0.61: R_CV_FREQ3.1 105.05,21.01 R_CV_FREQ_BIAS3.1 104.54,24.06 101.49,27.11 96.41,27.11 | CEM3.15 97.81,25.71 96.41,27.11 | 96.41,27.11 96.39,27.13 81.06,27.13 R_CV_FREQ_STAB3.1
FREQ_CTRL_VCOB
  Bottom 0.61: R_CV_FREQ1.1 40.36,103.51 R_CV_FREQ_BIAS1.1 31.21,110.11 26.64,110.11 | CEM1.15 28.42,108.34 26.64,110.11 | 26.64,110.11 22.2,110.11 22.07,110.24 13.16,110.24 R_CV_FREQ_STAB1.1
FREQ_CV_VCF
  Bottom 0.61: VCF.12 140.22,21.02 141.97,19.27 141.97,15.18 135.62,8.83 R2_VCF.1 R1_VCF.1
GAIN1_A  (1 unrouted)
  Bottom 0.4: U1.17 62.2,97.66
  Bottom 0.508: MIXER_A.3 80.31,109.88 78.47,108.04 73.77,108.04
GAIN1_B  (1 unrouted)
  Bottom 0.4: U1.24 66.75,97.68
  Bottom 0.508: 124.71,107.19 124.21,106.68
  Bottom 0.61: MIXER_B.3 126.75,109.22 124.71,107.19
GAIN2_A  (1 unrouted)
  Bottom 0.4: U1.21 64.8,99.94
  Bottom 0.508: MIXER_A.6 87.93,111.59 85.47,114.05 68.84,114.05 64.15,109.37
GAIN2_B  (1 unrouted)
  Bottom 0.4: 67.39,100.9 U1.25
  Bottom 0.508: MIXER_B.6 134.37,100.46
GAIN3_A  (1 unrouted)
  Bottom 0.4: U1.15 60.9,101.22
  Bottom 0.508: 61.21,121.95 87.49,121.95 88.85,120.59 88.85,119.06 MIXER_A.11
GAIN3_B  (1 unrouted)
  Bottom 0.4: U1.22 65.44,98.75
  Bottom 0.508: MIXER_B.11 134.37,118.19 132.16,120.4 125.5,120.4 121.97,123.93 119.36,123.93 117.09,121.67 115.79,121.67 112.39,118.27 112.39,102.62
GAIN4_A  (1 unrouted)
  Bottom 0.4: U1.16 61.55,98.17
GAIN4_B  (1 unrouted)
  Bottom 0.4: U1.23 66.09,98.17
  Bottom 0.508: MIXER_B.14 125.67,116.78 125.67,116.44 124.28,115.06 115.54,115.06 114.55,114.08 114.55,103.12
HARD_SYNC_VCOA
  Bottom 0.61: C1_SYNC3.2 76.14,20.33 76.14,24.58 80.44,28.89 85.51,28.89 87.65,31.02 CEM3.6
HARD_SYNC_VCOB
  Bottom 0.61: C1_SYNC1.2 8.36,102.37 8.36,110.5 9.37,111.51 17.63,111.51 18.26,112.15 CEM1.6
IA_VCO13700
  Bottom 0.61: VCO2.16 15.75,50.13 19.56,53.94 REE_2.1
IN1_MIXERA  (1 unrouted)
IN1_VCF
  Bottom 0.61: RC1_VCF.2 118.3,39.31 RF1_VCF.2 120.49,39.42 126.74,39.42 VCF.1
IN2_MIXERA  (1 unrouted)
IN2_MIXERB  (1 unrouted)
IN2_VCF
  Top 0.61: RF2_VCF.1 RC2_VCF.1 119.11,27.32 118.87,27.56 118.87,32.19 122.92,36.24 RB1_VCF.2
  Bottom 0.61: RB1_VCF.2 126.02,37.91 127.25,36.68 127.25,35.97 129.5,33.72 VCF.2
IN3_MIXERA  (1 unrouted)
IN3_MIXERB  (1 unrouted)
IN3_VCF
  Bottom 0.61: RF3.1 147.18,35.5 145.4,33.72 VCF.17 136.25,33.72 134.98,34.99 134.98,38.17 RB3_VCF.2 137.76,40.95 137.76,43.24 136.88,44.12 133.95,44.12 RC3.1
IN4_MIXERA  (1 unrouted)
IN4_MIXERB  (1 unrouted)
IN4_VCF
  Bottom 0.508: RF4.1 144,42.74 145.78,42.74
  Bottom 0.61: VCF.18 145.14,36.26 145.78,36.9 145.78,39.5 146.1,39.82 RC4.1 147.18,42.8 | RB2.2 147.19,42.82 147.18,42.8 | 145.78,42.74 147.12,42.74 147.18,42.8
IN_VCA  (1 unrouted)
IN_VCF  (1 unrouted)
IN_VCFORDER
  Bottom 0.61: VCF_ANALOG_SW.1 VCF_ANALOG_SW.16 140.34,49.91 R_PD_4TH_ORDER_VCF.2
INPUT_CURRENT_SUM_STG
  Bottom 0.4: JP1.2 131.83,92.1 131.95,91.98
  Bottom 0.61: SUM_STG_HEADER.4 SUM_STG_HEADER.3 | SUM_STG_HEADER.2 SUM_STG_HEADER.4 | SUM_STG_HEADER.4 131.95,91.98 SUM_STG_HEADER.6 | SUM_STG_HEADER.6 SUM_STG_HEADER.8 SUM_STG_HEADER.7 SUM_STG_HEADER.5 | SUM_STG_HEADER.5 SUM_STG_HEADER.6 | SUM_STG_HEADER.5 SUM_STG_HEADER.3 | SUM_STG_HEADER.3 SUM_STG_HEADER.1 | SUM_STG_HEADER.1 125.76,86.9 SUM_STG_R.2 123.47,82.07 SUM_STG_C.2 123.98,76.1 OPAMP_SUM_STG.2 | 127.88,92.4 SUM_STG_HEADER.2 | SUM_STG_HEADER.2 SUM_STG_HEADER.1
JACK_SUM_STG
  Bottom 0.61: COUT_SUM_STG.- 139.73,74.83 139.73,67.54 JACK_SUM_STG.3 138.13,65.94 116.87,65.94
LINEAR_CTRL_VCOA
  Bottom 0.61: CEM3.13 R8_3.1 95.65,14.53 R10_3.1 96.83,14.63 R_FM_LIN3.1
LINEAR_CTRL_VCOB
  Bottom 0.61: CEM1.13 23.59,106.18 R8_1.1 25.65,96.88 R10_1.1 25.55,91.57 R_FM_LIN1.1
MIXER_OUT1  (1 unrouted)
  Bottom 0.4: JP_MIXER_A.7 JP_MIXER_A.5 JP_MIXER_A.3 JP_MIXER_A.1 | JP_MIXER_B.7 JP_MIXER_B.5 JP_MIXER_B.3 JP_MIXER_B.1 146.14,118.2 145.96,118.2
  Bottom 0.508: 146.05,118.3 145.96,118.2 144.8,117.05 C_CONV_ITOV_OUT.1 144.8,112.61 144.1,111.91 144.1,110.76 | 144.1,110.76 R_CONV_ITOV_OUT.1 | 144.1,110.76 144.69,110.76 CONV_ITOV_OUT.2
N$5
  Bottom 0.4: R_SW1A.2 110.44,79.48 R_SW1B.1 112.39,73.2 112.39,46.43 100.58,46.43 S1.4 S1.3
N$7
  Bottom 0.4: S2.4 S2.3 56.25,47.86 55.13,48.98 49.79,48.98 R_SW2B.1 R_SW2A.2
N$20
  Top 0.61: RSTAB2_MIXERB.2 118.36,105.16 116.59,103.38 CSTAB2_MIXERB.2
N$21
  Bottom 0.61: RSTAB_VCA.2 107.06,111.63 CSTAB_VCA.2
N$22
  Bottom 0.508: CSTAB3_MIXERB.2 107.82,127.38 RSTAB3_MIXERB.2
N$24
  Bottom 0.61: RSTAB4_MIXERB.2 107.31,121.03 CSTAB8.2
N$62
  Bottom 0.61: RIN_VCA.2 107.31,114.68 CIN_VCA.2
N$65
  Bottom 0.61: RIN3_MIXERB.2 107.82,124.33 CIN3_MIXERB.2
N$69
  Top 0.61: CIN2_MIXERB.2 RIN2_MIXERB.2
N$70
  Bottom 0.61: RIN4_MIXERB.2 107.06,117.98 CIN4_MIXERB.2
N$74
  Top 0.508: RSTAB2_MIXERA.2 78.57,101.66 61.15,101.66 CSTAB2_MIXERA.2
N$75
  Bottom 0.61: CSTAB1_MIXERA.2 59.05,111.63 61.89,108.8 RSTAB1_MIXERA.2
N$76
  Bottom 0.508: CSTAB3_MIXERA.2 60.81,127.02 RSTAB3_MIXERA.2
N$77
  Bottom 0.61: RSTAB4_MIXERA.2 61.45,120.04 CSTAB4_MIXERA.2
N$78
  Bottom 0.61: CIN1_MIXERA.2 59.56,116.08 61.89,113.75 RIN1_MIXERA.2
N$79
  Bottom 0.61: CIN3_MIXERA.2 60.68,123.85 RIN3_MIXERA.2
N$80
  Top 0.508: RIN2_MIXERA.2 79.14,105.54 60.71,105.54 CIN2_MIXERA.2
N$81
  Bottom 0.61: RIN4_MIXERA.2 61.32,116.86 CIN4_MIXERA.2
N$82
  Bottom 0.61: C_CV_FREQ_STAB1.2 10.04,118.4 R_CV_FREQ_STAB1.2
N$83  (1 unrouted)
N$84
  Bottom 0.61: C_FM_LIN1.1 R_FM_LIN1.2
N$86
  Bottom 0.61: R_CV_FREQ_STAB3.2 76.08,29.77 C_CV_FREQ_STAB3.2
N$87
  Bottom 0.61: R10_3.2 97.56,7.55 100.46,7.55 C4_3.1
N$88
  Bottom 0.61: 3.2 R1_7.2 62.46,16.48 C1_1.2
N$89
  Bottom 0.61: 3.7 60.35,29.52 63.01,32.19 C2_1.2 63.01,31.91 69.13,31.91 73.43,27.61 R2_7.2
N$90
  Bottom 0.61: C3_1.2 44.95,32.16 44.95,28.12 R3_4.2 48.6,29.52 3.10
N$91
  Bottom 0.61: R2S_1.2 3.6
N$92  (1 unrouted)
N$94
  Bottom 0.61: R5_EXPCONV2.2 20.19,20.28 25.27,20.28 EXPCONV2.6
N$95
  Bottom 0.61: VCO2.12 25.91,50.76 25.27,51.4 | VCO2.10 30.99,53.3 30.35,53.94 26.54,53.94 25.27,52.67 25.27,51.4 | VCO2.3 20.83,47.59 | RA_2.2 9.3,40.45 9.3,46.32 19.56,46.32 20.83,47.59 | 25.27,51.4 21.46,51.4 20.83,50.76 VCO2.14 20.83,47.59
N$96
  Bottom 0.61: CF_2.2 19.56,33.62 20.19,32.98 25.27,32.98 25.91,33.62 VCO2.5 25.91,43.14 26.54,43.78 30.35,43.78 30.99,43.14 VCO2.7
N$97
  Bottom 0.61: SUBBASS2.10 30.99,79.34 29.72,80.61 23.37,80.61 20.83,78.07 SUBBASS2.14
N$98
  Bottom 0.61: R_LIM_2.2 10.67,66.13 8.89,67.91 D_2.C
N$99
  Bottom 0.61: RTEST_LOG2.1 10.03,28.54 HEADER_EXPCONV2.1
N$113
  Bottom 0.61: VCF_ANALOG_SW.14 VCF_ANALOG_SW.3 135.13,57.81 133.21,59.72 118.88,59.72 114.83,55.66 114.83,21.37 CRES_VCF.1
N$116
  Top 0.61: RC1_VCF.1 118.24,52.24 118.26,52.22 C_IN2.1
NOISE_GENE
  Bottom 0.4: U1.30 71.94,92.71 73.42,94.19
OUT1_VCF
  Top 0.61: RF1_VCF.1 120.38,28.01 RC2_VCF.2
  Bottom 0.61: VCF.7 127.36,21.02 RC2_VCF.2
OUT2_VCF
  Top 0.61: RC3.2 130.66,43.76 132.85,45.94 135.37,45.94 137.67,48.24 VCF_ANALOG_SW.15
  Bottom 0.61: RF2_VCF.2 125.22,19.86 125.22,22.28 126.5,23.56 VCF.6 130.31,23.56 132.22,25.48 132.22,37.5 RC3.2
OUT3_VCF
  Bottom 0.61: VCF.15 143.37,28.64 148.04,33.32 152.36,33.32 RF3.2 RC4.2
OUT4_VCF  (via drill 0.6)
  Top 0.61: v142.88,51.82 142.88,48.26 137.23,42.61 RF4.2
  Bottom 0.61: VCF.10 135.62,15.94 133.71,17.85 133.71,40.07 RF4.2 | VCF_ANALOG_SW.2 137.67,57.81 139.58,59.72 140.83,59.72 142.88,57.68 v142.88,51.82
OUT_EXPCONV_VCO13700
  Bottom 0.61: HEADER_EXPCONV2.2 17.02,26 15.02,24 15.02,22.19 19.56,17.65 CONVLOG2.3
OUT_MIXER  (1 unrouted)
  Bottom 0.508: C_CONV_ITOV_OUT.2 151.66,112.48 R_CONV_ITOV_OUT.2 151.13,110.17 151.13,102.62 150.88,102.36 144.74,102.36 CONV_ITOV_OUT.6 142.71,102.59 138.64,102.59
OUT_SUM_STG
  Bottom 0.61: SUM_STG_C.1 130.08,68.99 130.84,69.75 130.84,73.56 | SUM_STG_R.1 ROUT_SUM_STG.2 132.74,81.18 130.84,79.28 130.84,73.56 | OPAMP_SUM_STG.6 130.84,73.56
OUT_VCA
  Bottom 0.508: MIXER_B.4 JP1.1
OUT_VCF  (1 unrouted)
  Top 0.61: CRES_VCF.2 117.46,13.4 130.31,13.4 135.21,18.3 135.21,36.89 136.09,37.77 136.9,37.77 142.36,43.24
  Bottom 0.61: RRI_VCF.2 116.31,9.59 CRES_VCF.2
PNP1_B_VCO13700
  Bottom 0.508: R2_EXPCONV2.1 38.26,7.93 R1_EXPCONV2.1
  Bottom 0.61: R1_EXPCONV2.1 34.7,5.58 24.73,5.58 22.73,7.58 22.73,8.85 21.46,10.12 CONVLOG2.2
PNP1_C1_VCO1  (via drill 1.02)
  Top 0.61: RBIAS_EXPCONV2.2 24.64,6.31 23.37,5.04 v15.75,5.04
  Bottom 0.61: EXPCONV2.2 RBIAS_EXPCONV2.2 | CONVLOG2.6 13.21,7.58 v15.75,5.04
PNP2_B_VCO13700
  Bottom 0.508: R3_EXPCONV2.1 7.46,9.23 9.4,11.18
  Bottom 0.61: R4_EXPCONV2.1 11.94,15.2 10.67,15.2 9.4,13.93 9.4,11.18 9.4,10.76 10.03,10.12 CONVLOG2.5
PNP_E1-VCO1_MIXB
  Bottom 0.61: CONVLOG2.4 14.48,12.66 | CONVLOG2.1 17.02,7.58 14.48,10.12 14.48,12.66 | R5_EXPCONV2.1 16.38,15.84 14.48,13.93 14.48,12.66
POT2_SUM_STG
  Bottom 0.61: COUT_SUM_STG.+ 149.89,76.1 POT_SUM_STG.2
POT3_SUM_STG
  Bottom 0.61: POT_SUM_STG.3 149.97,79.83 ROUT_SUM_STG.1
PULSE_OUT_VCOA
  Bottom 0.61: 3.11 48.62,26.98 R3S_1.2
PULSE_VCOA
  Top 0.61: R6_3.2 79.27,35.87 76.02,39.12 62.07,39.12 C3_1.1
  Bottom 0.61: CEM3.4 R6_3.2 91.97,35.87 TP_PULSE3.P$1
REFOUT
  Bottom 0.4: U1.5 58.52,89.43 57.79,89.43 55.43,87.08 CDEC_VREF.1
RES_CUR_IN_VCF
  Bottom 0.61: RRI_VCF.1 124.82,8.96 124.82,14.16 129.14,18.48 VCF.8
RES_CUR_VCF
  Bottom 0.61: VCF.9 R_RES_VCF.1
RST  (via drill 0.6)
  Top 0.4: v77.99,64.98 73.92,69.04 66.05,69.04 63.51,71.58 63.51,73.94 68.95,79.38 68.95,94.04 70.11,95.2 82.43,95.2 R_RST.2
  Bottom 0.4: U1.37 72.64,88.16 73.28,87.52 73.28,87.5 76.34,87.5 76.34,92.71 79.34,95.71 R_RST.2 82.94,96.02 84.45,97.54 91.28,97.54 91.7,97.11 IC1.18 | STM32L432KC_CONN_.3.6 78.11,64.85 v77.99,64.98
SAW_3340_VCOA
  Bottom 0.61: TP_SAW3.P$1 80.92,41.59 R7_3.1 79.9,41.41 73.98,35.49 C2_1.1
SAW_VCOA
  Bottom 0.61: CEM3.8 R7_3.2
SAW_VCOB
  Bottom 0.61: CEM1.8 13.18,116.34 R7_1.2
SCALE_VCOA
  Bottom 0.61: CEM3.14 R11_3.1
SCALE_VCOB
  Bottom 0.61: CEM1.14 R11_1.1
SCL
  Bottom 0.4: STM32L432KC_CONN_.4.6 75.32,70.19 | 75.32,70.19 56.27,70.19 55.38,71.07 IC_EEPROM.6 | 75.32,70.19 100.32,70.19 102.48,72.35 102.48,73.6 97.14,78.95 91.77,78.95 90.43,80.28 IC1.12
SDA  (via drill 0.6)  (1 unrouted)
  Top 0.4: v95.12,77.22 v102.36,77.22
  Bottom 0.4: 94.72,69.2 96.88,67.04 96.88,62.89 100.97,58.8 STM32L432KC_CONN_.3.15 | 94.72,69.2 94.62,69.3 55.76,69.3 55,68.53 IC_EEPROM.5 | 94.72,69.2 101.26,69.2 104.15,72.09 104.15,75.52 102.45,77.22 v102.36,77.22 | IC1.13 | v95.12,77.22 91.46,77.22 89.15,79.53 89.15,85.09
SOFT_SYNC_VCOA
  Bottom 0.61: C2_SYNC3.2 82.7,23.68 CEM3.9
SOFT_SYNC_VCOB
  Bottom 0.61: C2_SYNC1.2 CEM1.9
SPI_CLK  (via drill 0.6)
  Top 0.4: v76.81,77.65 89.13,77.65 v89.16,77.68
  Bottom 0.4: U1.49 62.2,81.79 60.75,80.34 60.75,78.19 62.32,76.62 65.11,76.62 66.55,78.06 76.59,78.06 76.81,77.84 v76.81,77.65 | v89.16,77.68 90.81,76.03 STM32L432KC_CONN_.4.11
SPI_MISO
  Bottom 0.4: U1.48 62.84,81.2 61.73,80.09 61.73,78.48 62.76,77.44 64.16,77.44 65.66,78.95 77.48,78.95 80.66,75.77 STM32L432KC_CONN_.4.7
SPI_MOSI  (via drill 0.6)
  Top 0.4: v62.14,75.32 62.14,68.64 65.8,64.98 v68.84,64.98
  Bottom 0.4: U1.50 61.55,82.95 59.9,81.3 59.9,77.48 62.06,75.32 v62.14,75.32 | v68.84,64.98 72.4,64.98 75.58,61.8 STM32L432KC_CONN_.3.5
SUBBASS_IN_VCO13700
  Bottom 0.61: SUBBASS2.13 23.37,73.62 22.41,72.67 15.11,72.67 14.16,73.62 R_LIM_2.1
SW1
  Bottom 0.4: STM32L432KC_CONN_.3.14 98.44,56.22 98.56,56.09 100.34,56.09 C_SW1.1 110.48,59.88 R_SW1B.2
SW2
  Bottom 0.4: STM32L432KC_CONN_.3.13 95.89,66.76 94.37,68.28 56.02,68.28 54.67,66.93 50.29,66.93 49.54,66.18 49.54,59.14 R_SW2B.2 51.54,59.01 C_SW2.1
SYNC_3340_VCOA
  Bottom 0.61: C1_SYNC3.1 77.62,9.96 R_SYNC3.2 74.75,7.1 66.91,7.1 65.12,8.89 56.84,8.89 53.82,11.91 52.42,11.91 51.82,12.52 51.82,12.57 51.63,12.75 49.71,12.75 49.16,13.31 49.16,15.12 50.86,16.82 3.15
SYNC_3340_VCOB
  Bottom 0.61: C1_SYNC1.1 R_SYNC1.2
SYNC_IN_VCOA
  Bottom 0.61: 3.14 51.46,19.49 SYNC_IN1.P$1
TEMPCO1_VCOA
  Bottom 0.61: R1_4.1 100.35,33.97 CEM3.1
TEMPCO1_VCOB
  Bottom 0.61: CEM1.1 36.3,114.05 R1_3.1
TEMPCO2_VCOA
  Bottom 0.61: CEM3.2 97.81,33.33 98.95,34.47 R2_4.1
TEMPCO2_VCOB
  Bottom 0.61: CEM1.2 28.42,115.96 28.96,116.5 35.06,116.5 R2_3.1
TIMING_CAP_VCOA
  Bottom 0.61: CEM3.11 C_3.2
TIMING_CAP_VCOB
  Bottom 0.61: CEM1.11 C_1.2
TRI_3340_VCOA
  Top 0.61: C1_1.1 68.47,11.92 TP_TRI3.P$1
  Bottom 0.61: C1_1.1 71.43,14.88 81.12,14.88 85.11,18.87 CEM3.10
TRI_OUT_VCOA
  Bottom 0.61: 3.3 R1S_1.1
USART_RX_RPI_TX
  Bottom 0.4: STM32L432KC_CONN_.3.7 78.03,55.12 68.33,55.12 66.8,53.59 66.8,50.98 CONN_UART_RPI.2
USART_TX_RPI_RX
  Bottom 0.4: STM32L432KC_CONN_.3.8 79.56,54.1 72.14,54.1 69.39,51.35 CONN_UART_RPI.3
VCO440A_OUT  (1 unrouted)
  Top 0.61: R1S_1.2 68.85,19.36 67.48,17.99 67.48,14.9 62.93,10.36 52.56,10.36 48.59,14.33 R3S_1.1
  Bottom 0.61: R2S_1.1 R1S_1.2
VCO3340B_FMLIN  (1 unrouted)
VCO3340B_PULSE_OUT  (1 unrouted)
  Bottom 0.61: CEM1.4 R6_1.2 23.34,120.4 21.34,122.4 21.34,126.25 23.11,128.02 TP_PULSE1.P$1
VCO3340B_SAW_OUT  (1 unrouted)
  Bottom 0.61: R7_1.1 17.12,130.43 38.07,130.43 TP_SAW1.P$1
VCO3340B_TRI_OUT  (1 unrouted)
  Bottom 0.61: CEM1.10 15.72,95.28 19.55,91.44 TP_TRI1.P$1 17.62,88.9 4.83,88.9
VCO13700_SQUARE  (1 unrouted)
  Top 0.508: 13.21,75.18 10.54,77.85
  Top 0.61: 13.21,75.18 CIN_2.2
  Bottom 0.61: TP_13700_SQU2.P$1 RSQU_2.2 37.34,38.06 37.34,46.32 34.8,48.86 VCO2.9 33.53,53.46 31.14,55.84 25.91,55.84 22.1,59.65 14.48,59.65 CIN_2.2
VCO13700_SUBBASS  (1 unrouted)
  Bottom 0.61: SUBBASS2.15 RCAL_1.1
VCO13700_TRI  (1 unrouted)
  Bottom 0.508: 34.8,32.35 38.48,28.66 RTRI_2.2 38.61,26 TP_13700_TRI2.P$1
  Bottom 0.61: VCO2.13 23.27,48.76 23.27,47 24.59,45.68 31.62,45.68 33.53,43.78 VCO2.8 34.8,39.97 34.8,32.35
VEE_VCF
  Bottom 0.61: C-15V_VCF.1 C-15VPOL_VCF.1 146.29,23.44 REE_VCF.2 143.62,23.56 VCF.13
VEE_VCOA
  Bottom 0.61: CEM3.3 95.27,33.33 96.03,34.09 R3_3.2 96.03,40.44 R2_4.2 R1_4.2 103.02,42.47 CDEC_3340B6.2 105.81,34.22 CDEC_3340B7.2
VEE_VCOB
  Bottom 0.61: CEM1.3 25.88,115.19 29.18,118.5 R3_1.2 30.96,120.02 R2_3.2 R1_3.2 41.12,121.92 CDEC_3340B2.2 37.82,112.78 CDEC_3340B3.2

## Text on the board
tDocu: VCO3340B | VCO3340A